# Altium schematic sheet TLV320DAC3100.SchDoc
size A4; SheetNumber: 3; SheetTotal: 7; SheetSize: A4; DrawingNumber: SCH-001
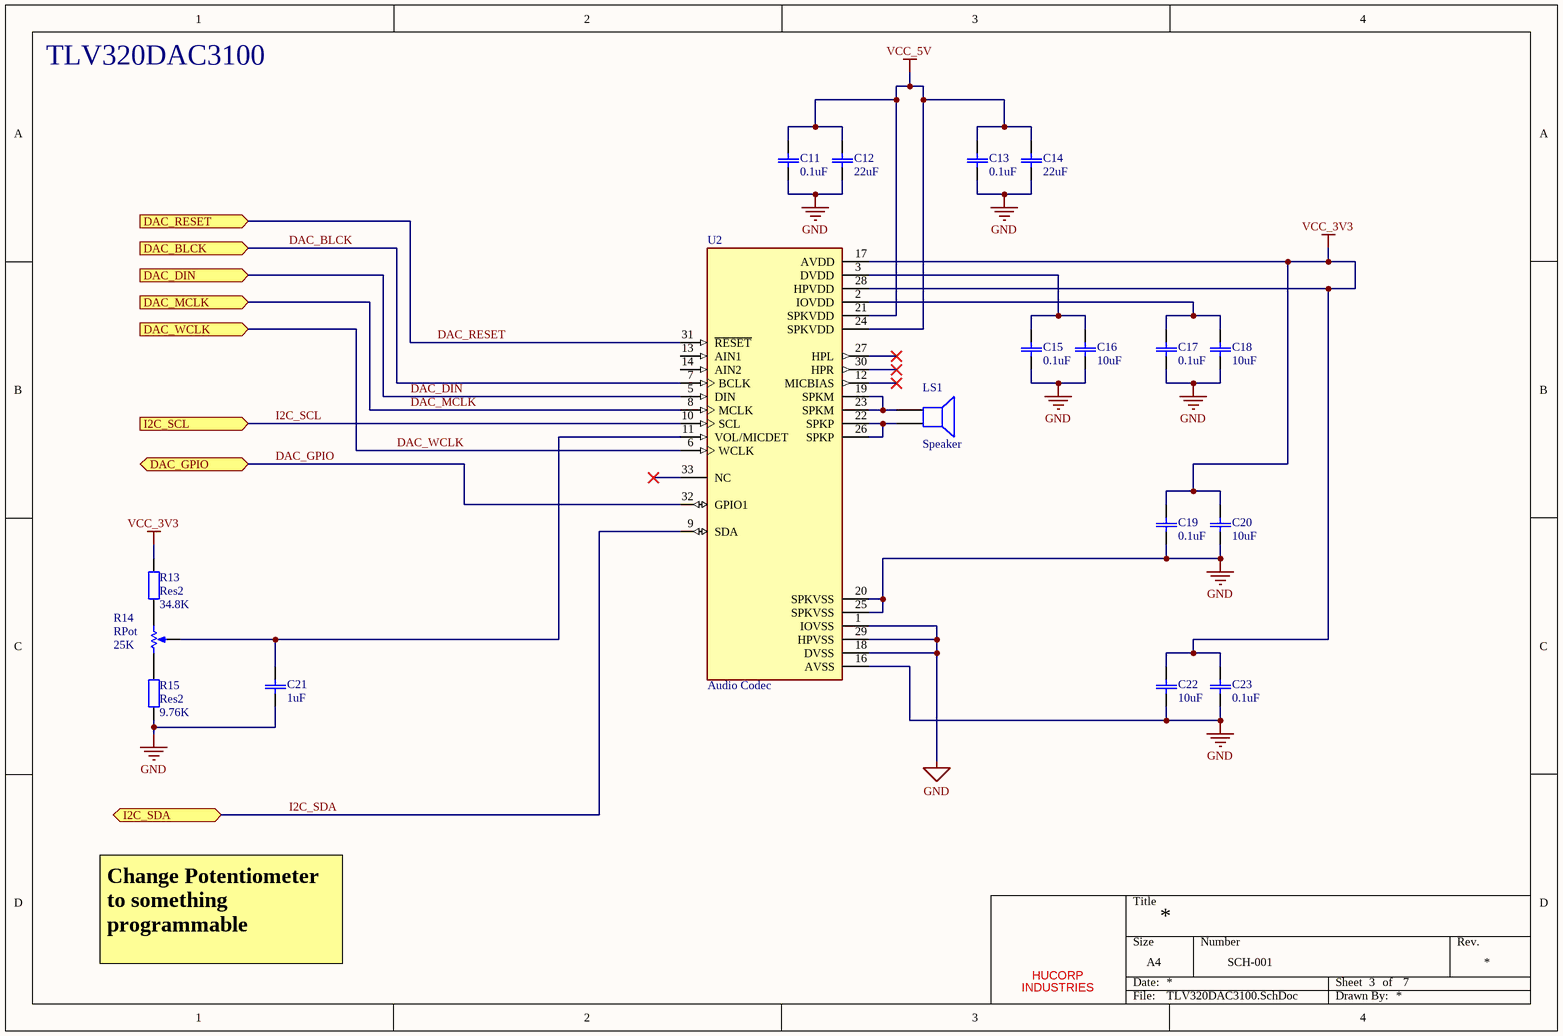
[diagram p0: TLV320DAC3100.SchDoc]

## Parts
*  HUCORP  (value not drawn)  (graphical)
C11  value 0.1uF  [CAP_CL10_SAM]  (hidden comment: 100 nF)
C12  value 22uF  [CAP_CL10_SAM]  (hidden comment: CL10A226MP8NUNE)
C13  value 0.1uF  [CAP_CL10_SAM]  (hidden comment: 100 nF)
C14  value 22uF  [CAP_CL10_SAM]  (hidden comment: CL10A226MP8NUNE)
C15  value 0.1uF  [CAP_CL10_SAM]  (hidden comment: 100 nF)
C16  value 10uF  [CAP_CL10_SAM]  (hidden comment: 10 uF)
C17  value 0.1uF  [CAP_CL10_SAM]  (hidden comment: 100 nF)
C18  value 10uF  [CAP_CL10_SAM]  (hidden comment: 10 uF)
C19  value 0.1uF  [CAP_CL10_SAM]  (hidden comment: 100 nF)
C20  value 10uF  [CAP_CL10_SAM]  (hidden comment: 10 uF)
C21  1uF  [CAP_CL10_SAM]
C22  value 10uF  [CAP_CL10_SAM]  (hidden comment: 10 uF)
C23  value 0.1uF  [CAP_CL10_SAM]  (hidden comment: 100 nF)
LS1  Speaker  [PIN2]
R13  Res2  value 34.8K  [AXIAL-0.4]
R14  RPot  value 25K  [VR5]
R15  Res2  value 9.76K  [AXIAL-0.4]
U2  Audio Codec  [IC_ADS125H01IRHBT]

## Ports
DAC_BLCK (in), DAC_DIN (in), DAC_GPIO (bidir), DAC_MCLK (in), DAC_RESET (in), DAC_WCLK (in), I2C_SCL (in), I2C_SDA (bidir)

## Nets
GND: C11.1 C12.1 C13.1 C14.1 C15.1 C16.1 C17.1 C18.1 C19.1 C20.1 C21.1 C22.1 C23.1 R15.1 U2.1(IOVSS) U2.16(AVSS) U2.18(DVSS) U2.20(SPKVSS) U2.25(SPKVSS) U2.29(HPVSS)
VCC_3V3: C19.2 C20.2 C22.2 C23.2 R13.2 U2.17(AVDD) U2.28(HPVDD)
VCC_5V: C11.2 C12.2 C13.2 C14.2 U2.21(SPKVDD) U2.24(SPKVDD)
DAC_BLCK: U2.7(BCLK) ; port DAC_BLCK
DAC_DIN: U2.5(DIN) ; port DAC_DIN
DAC_GPIO: U2.32(GPIO1) ; port DAC_GPIO
DAC_MCLK: U2.8(MCLK) ; port DAC_MCLK
DAC_RESET: U2.31(~{RESET}) ; port DAC_RESET
DAC_WCLK: U2.6(WCLK) ; port DAC_WCLK
I2C_SCL: U2.10(SCL) ; port I2C_SCL
I2C_SDA: U2.9(SDA) ; port I2C_SDA
NetC15_2: C15.2 C16.2 U2.3(DVDD)
NetC17_2: C17.2 C18.2 U2.2(IOVDD)
NetC21_2: C21.2 R14.3(TAP) U2.11(VOL/MICDET)
NetLS1_1: LS1.1 U2.19(SPKM) U2.23(SPKM)
NetLS1_2: LS1.2 U2.22(SPKP) U2.26(SPKP)
NetR13_1: R13.1 R14.2(BOT)
NetR14_1: R14.1(TOP) R15.2

Not connected (* = marked no-connect by the designer): U2 12(MICBIAS)* 13(AIN1) 14(AIN2) 27(HPL)* 30(HPR)* 33(NC)*

## Notes on the sheet
- TLV320DAC3100
- Change Potentiometer to something programmable
- (in symbol TitleBlock1) Title; Size; Number; Rev.; INDUSTRIES; Date:; Sheet; of; File:; Drawn By:

## Library data of the parts
* = TitleBlock1: HUCORP Title Block
C11 C13 C15 C17 C19 C23 = CL10B104KA8NNNC: CAP CER 0.1UF 25V X7R 0603; Mfr_Name: Samsung; Type: DEV; Copyright: Copyright (C) 2022 Ultra Librarian. All rights reserved.; Manufacturer_Part_Number: CL10B104KA8NNNC; Digi-Key_Part_Number_1: 1276-1006-2-ND; Digi-Key_Part_Number_2: 1276-1006-1-ND; Digi-Key_Part_Number_3: 1276-1006-6-ND; RefDes: RefDes
C12 C14 = CL10A226MP8NUNE: CAP CER 22UF 10V X5R 0603; Mfr_Name: Samsung; Type: DEV; Copyright: Copyright (C) 2023 Ultra Librarian. All rights reserved.; Manufacturer_Part_Number: CL10A226MP8NUNE; Digi-Key_Part_Number_1: 1276-1274-2-ND; Digi-Key_Part_Number_2: 1276-1274-1-ND; Digi-Key_Part_Number_3: 1276-1274-6-ND; RefDes: RefDes
C16 C18 C20 C22 = CL10A106MQ8NNNC: 10 µF ±20% 6.3V Ceramic Capacitor X5R 0603 (1608 Metric); Mfr_Name: Samsung; Type: DEV; Copyright: Copyright (C) 2022 Ultra Librarian. All rights reserved.; Manufacturer_Part_Number: CL10A106MQ8NNNC; Digi-Key_Part_Number_1: 1276-1119-2-ND; Digi-Key_Part_Number_2: 1276-1119-1-ND; Digi-Key_Part_Number_3: 1276-1119-6-ND; RefDes: RefDes
C21 = CL10A105KA8NNNC: CAP CER 1UF 25V X5R 0603; Mfr_Name: Samsung; Manufacturer_Part_Number: CL10B104KA8NNNC; Type: DEV; Copyright: Copyright (C) 2022 Ultra Librarian. All rights reserved.; Digi-Key_Part_Number_1: 1276-1006-2-ND; Digi-Key_Part_Number_2: 1276-1006-1-ND; Digi-Key_Part_Number_3: 1276-1006-6-ND; RefDes: RefDes; Value: 1uF
LS1 = Speaker: Loudspeaker; Published: 24-Mar-1999; LatestRevisionDate: 17-Jul-2002; LatestRevisionNote: Re-released for DXP Platform.; PackageReference: PIN2; Publisher: Altium Limited
R13 R15 = Res2: Resistor; Published: 8-Jun-2000; LatestRevisionDate: 17-Jul-2002; LatestRevisionNote: Re-released for DXP Platform.; PackageReference: AXIAL-0.4; Publisher: Altium Limited; PackageDescription: Axial Device, Thru-Hole; 2 Leads; 0.4 in Pin Spacing
R14 = RPot: Potentiometer; Sim Note: Enter the Resistance value and the set point into parameter fields.; Set Position: 0.5; Published: 8-Jun-2000; LatestRevisionDate: 17-Jul-2002; LatestRevisionNote: Re-released for DXP Platform.; PackageReference: VR5; Publisher: Altium Limited; PackageDescription: Variable Resistor, Thru-Hole; 3 Leads
U2 = TLV320DAC3100IRHBT: Low-Power Stereo Audio DAC With Mono Class-D Speaker Amplifier 32-VQFN -40 to 85; MF: Texas Instruments; Check_prices: https://www.snapeda.com/parts/TLV320DAC3100IRHBT/Texas%20Instruments/view-part/1191598/?ref=eda; Value: *; Purchase-URL: https://pricing.snapeda.com/search/part/TLV320DAC3100IRHBT/?ref=eda; Package: VQFN-32 Texas Instruments; Digi-Key_Part_Number: 296-39266-1-ND; MP: TLV320DAC3100IRHBT; SnapEDA_Link: https://www.snapeda.com/parts/TLV320DAC3100IRHBT/Texas%20Instruments/view-part/1191598/?ref=snap